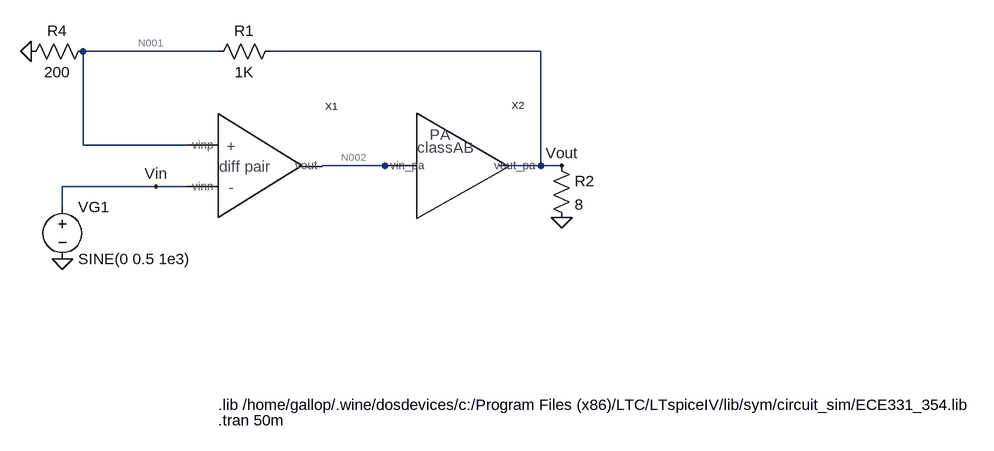
[diagram p0: schematic Lab5.asc]
Lab5.asc, the LTspice schematic file:
Version 4
SHEET 1 880 680
WIRE -528 -208 -736 -208
WIRE -32 -208 -448 -208
WIRE -736 -64 -736 -208
WIRE -576 -64 -736 -64
WIRE -272 -32 -368 -32
WIRE -256 -32 -272 -32
WIRE -32 -32 -32 -208
WIRE -32 -32 -96 -32
WIRE 0 -32 -32 -32
WIRE -624 0 -768 0
WIRE -576 0 -624 0
WIRE -768 32 -768 0
FLAG -816 -208 0
FLAG -768 112 0
FLAG 0 -32 Vout
FLAG -624 0 Vin
FLAG 0 48 0
SYMBOL voltage -768 16 R0
WINDOW 123 0 0 Left 2
WINDOW 39 0 0 Left 2
SYMATTR InstName VG1
SYMATTR Value SINE(0 0.5 1e3)
SYMBOL diffpair -496 -32 R0
SYMATTR InstName X1
SYMBOL res -432 -224 R90
WINDOW 0 0 56 VBottom 2
WINDOW 3 32 56 VTop 2
SYMATTR InstName R1
SYMATTR Value 1K
SYMBOL res -720 -224 R90
WINDOW 0 0 56 VBottom 2
WINDOW 3 32 56 VTop 2
SYMATTR InstName R4
SYMATTR Value 200
SYMBOL res -16 -48 R0
SYMATTR InstName R2
SYMATTR Value 8
SYMBOL PA_classAB -160 -32 R0
SYMATTR InstName X2
TEXT -528 336 Left 2 !.lib /home/gallop/.wine/dosdevices/c:/Program Files (x86)/LTC/LTspiceIV/lib/sym/circuit_sim/ECE331_354.lib
TEXT -528 360 Left 2 !.tran 50m

The netlist it stands for:
* Lab5.asc
VG1 Vin 0 SINE(0 0.5 1e3)
XX1 N001 Vin N002 diffpair  ; pins vinp vinn vout
R1 Vout N001 1K
R4 N001 0 200
R2 Vout 0 8
XX2 N002 Vout PA_classAB  ; pins vin_pa vout_pa
.lib /home/gallop/.wine/dosdevices/c:/Program Files (x86)/LTC/LTspiceIV/lib/sym/circuit_sim/ECE331_354.lib
.tran 50m
.backanno
.end

* Results of the author's LTspice run, read from the files saved beside the schematic
* Operating Point, zero values left out:
*   V(n002) = 79.96 mV
*   V(n001) = -43.82 mV
*   V(vout) = -262.9 mV
*   I(R2) = -32.87 mA
*   I(R4) = -219.1 µA
*   I(R1) = -219.1 µA
*   Ix(x1:VOUT) = -68.58 µA
*   Ix(x2:VIN_PA) = 68.58 µA
*   Ix(x2:VOUT_PA) = 33.09 mA
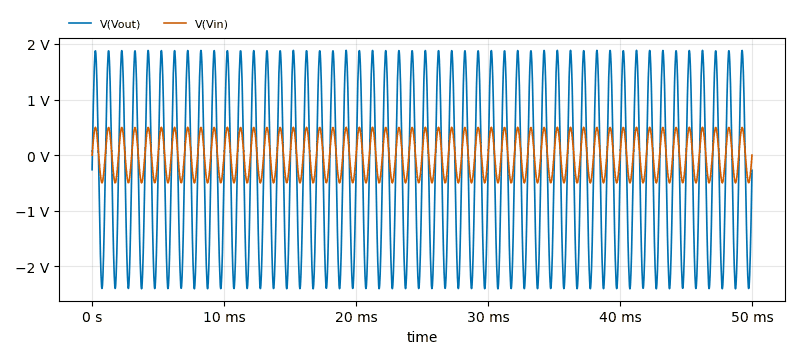
[diagram p1: Transient Analysis of Lab5.asc, plotted from the saved traces]
* Transient Analysis, 1 run:
*   V(Vout): min -2.404 V, max 1.884 V, average -259.1 mV, rms 1.524 V, last -271.9 mV
*   V(Vin): min -498.8 mV, max 498.8 mV, average 573.9 µV, rms 349.2 mV, last 0 V